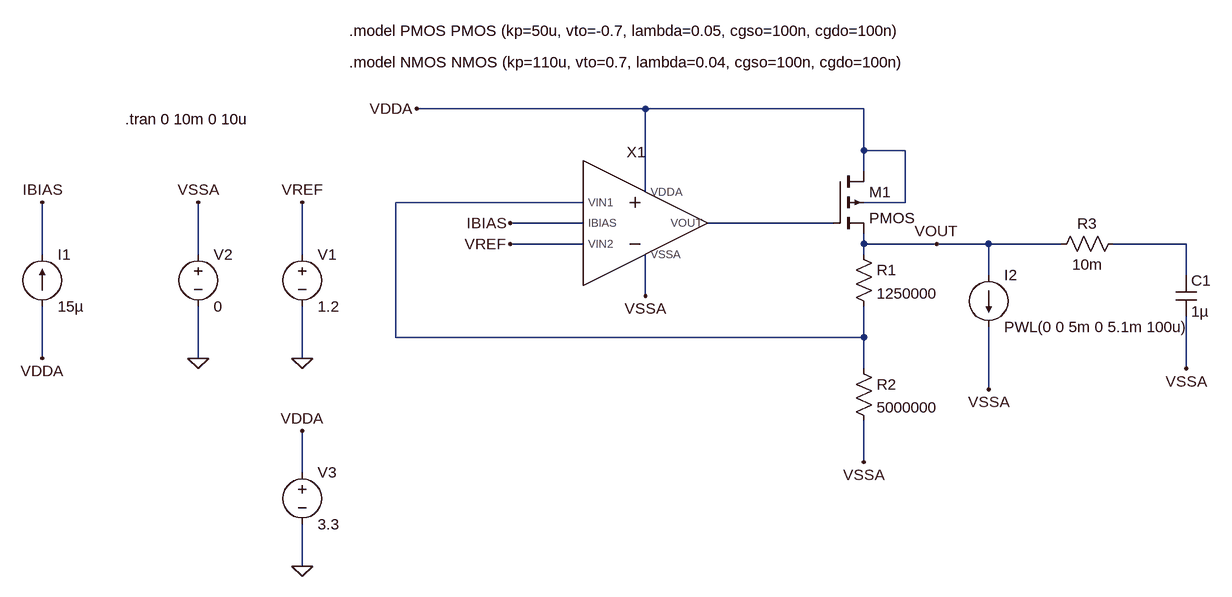
[diagram p0: schematic LDO_Transient_TB.asc]
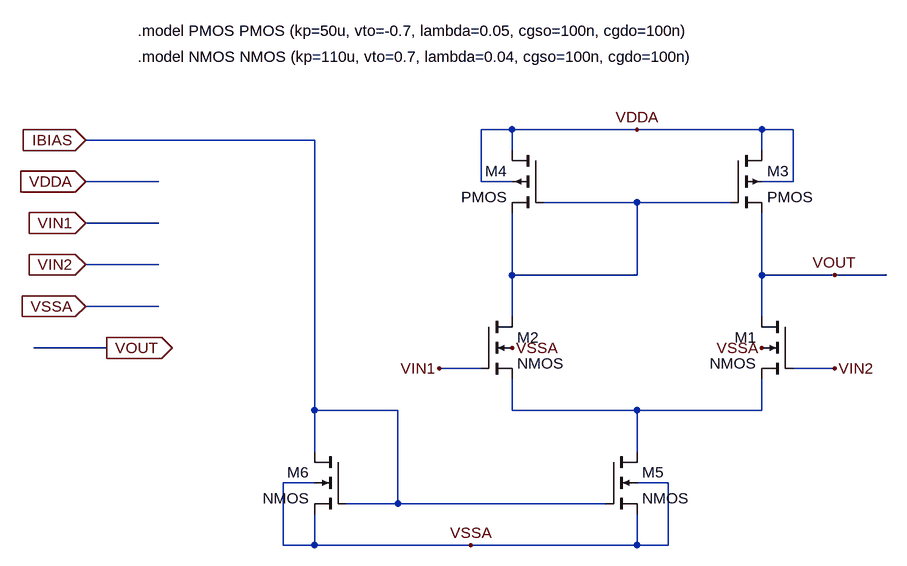
[diagram p1: sub-circuit 5tr_amp.asc]
LDO_Transient_TB.asc, the LTspice schematic file:
Version 4
SHEET 1 1112 708
WIRE 224 -16 -128 -16
WIRE 560 -16 224 -16
WIRE 560 48 560 -16
WIRE 624 48 560 48
WIRE 560 80 560 48
WIRE 224 112 224 -16
WIRE 128 128 -160 128
WIRE 624 128 624 48
WIRE 624 128 560 128
WIRE 128 160 16 160
WIRE 512 160 320 160
WIRE 128 192 16 192
WIRE 560 192 560 176
WIRE 672 192 560 192
WIRE 752 192 672 192
WIRE 864 192 752 192
WIRE 1056 192 944 192
WIRE -704 208 -704 128
WIRE -464 208 -464 128
WIRE -304 208 -304 128
WIRE 560 208 560 192
WIRE 752 240 752 192
WIRE 1056 240 1056 192
WIRE 224 272 224 208
WIRE -160 336 -160 128
WIRE 560 336 560 288
WIRE 560 336 -160 336
WIRE -704 368 -704 288
WIRE -464 368 -464 288
WIRE -304 368 -304 288
WIRE 560 384 560 336
WIRE 1056 384 1056 304
WIRE 752 416 752 320
WIRE 560 528 560 464
WIRE -304 544 -304 480
WIRE -304 688 -304 624
FLAG -128 -16 VDDA
FLAG 1056 384 VSSA
FLAG 224 272 VSSA
FLAG 16 160 IBIAS
FLAG 16 192 VREF
FLAG 560 528 VSSA
FLAG 752 416 VSSA
FLAG -464 368 0
FLAG -304 368 0
FLAG -304 688 0
FLAG -704 128 IBIAS
FLAG -464 128 VSSA
FLAG -304 128 VREF
FLAG -304 480 VDDA
FLAG -704 368 VDDA
FLAG 672 192 VOUT
SYMBOL 5TR_AMP 208 176 R0
SYMATTR InstName X1
SYMBOL pmos4 512 80 R0
SYMATTR InstName M1
SYMATTR Value2 l=0.5u w=2000u
SYMBOL res 544 192 R0
SYMATTR InstName R1
SYMATTR Value 1250000
SYMBOL res 544 368 R0
SYMATTR InstName R2
SYMATTR Value 5000000
SYMBOL res 960 176 R90
WINDOW 0 0 56 VBottom 2
WINDOW 3 32 56 VTop 2
SYMATTR InstName R3
SYMATTR Value 10m
SYMBOL cap 1040 240 R0
SYMATTR InstName C1
SYMATTR Value 1µ
SYMBOL voltage -304 192 R0
WINDOW 123 0 0 Left 0
WINDOW 39 0 0 Left 0
SYMATTR InstName V1
SYMATTR Value 1.2
SYMBOL voltage -464 192 R0
WINDOW 123 0 0 Left 0
WINDOW 39 0 0 Left 0
SYMATTR InstName V2
SYMATTR Value 0
SYMBOL voltage -304 528 R0
WINDOW 123 0 0 Left 0
WINDOW 39 0 0 Left 0
SYMATTR InstName V3
SYMATTR Value 3.3
SYMBOL current -704 288 M180
WINDOW 0 24 80 Left 2
WINDOW 3 24 0 Left 2
WINDOW 123 0 0 Left 0
WINDOW 39 0 0 Left 0
SYMATTR InstName I1
SYMATTR Value 15µ
SYMBOL current 752 240 R0
WINDOW 123 0 0 Left 0
WINDOW 39 0 0 Left 0
SYMATTR InstName I2
SYMATTR Value PWL(0 0 5m 0 5.1m 100u)
TEXT -232 -136 Left 2 !.model PMOS PMOS (kp=50u, vto=-0.7, lambda=0.05, cgso=100n, cgdo=100n)
TEXT -232 -88 Left 2 !.model NMOS NMOS (kp=110u, vto=0.7, lambda=0.04, cgso=100n, cgdo=100n)
TEXT -576 0 Left 2 !.tran 0 10m 0 10u

5tr_amp.asc, the sub-circuit schematic file:
Version 4
SHEET 1 2008 1116
WIRE 368 -368 320 -368
WIRE 560 -368 368 -368
WIRE 752 -368 560 -368
WIRE 800 -368 752 -368
WIRE 64 -352 -288 -352
WIRE 368 -336 368 -368
WIRE 752 -336 752 -368
WIRE -176 -288 -288 -288
WIRE 320 -288 320 -368
WIRE 368 -288 320 -288
WIRE 800 -288 800 -368
WIRE 800 -288 752 -288
WIRE 560 -256 416 -256
WIRE 704 -256 560 -256
WIRE -176 -224 -288 -224
WIRE -176 -160 -288 -160
WIRE 368 -144 368 -240
WIRE 560 -144 560 -256
WIRE 560 -144 368 -144
WIRE 752 -144 752 -240
WIRE 864 -144 752 -144
WIRE 944 -144 864 -144
WIRE -176 -96 -288 -96
WIRE 368 -80 368 -144
WIRE 752 -80 752 -144
WIRE -256 -32 -368 -32
WIRE 320 0 256 0
WIRE 864 0 800 0
WIRE 64 64 64 -352
WIRE 192 64 64 64
WIRE 368 64 368 16
WIRE 560 64 368 64
WIRE 752 64 752 16
WIRE 752 64 560 64
WIRE 64 128 64 64
WIRE 560 128 560 64
WIRE 64 176 16 176
WIRE 608 176 560 176
WIRE 192 208 192 64
WIRE 192 208 112 208
WIRE 512 208 192 208
WIRE 16 272 16 176
WIRE 64 272 64 224
WIRE 64 272 16 272
WIRE 304 272 64 272
WIRE 560 272 560 224
WIRE 560 272 304 272
WIRE 608 272 608 176
WIRE 608 272 560 272
FLAG 368 -32 VSSA
FLAG 752 -32 VSSA
FLAG 256 0 VIN1
FLAG 864 0 VIN2
FLAG 560 -368 VDDA
FLAG 304 272 VSSA
FLAG 864 -144 VOUT
FLAG -288 -288 VDDA
IOPIN -288 -288 In
FLAG -288 -224 VIN1
IOPIN -288 -224 In
FLAG -288 -160 VIN2
IOPIN -288 -160 In
FLAG -288 -96 VSSA
IOPIN -288 -96 In
FLAG -256 -32 VOUT
IOPIN -256 -32 Out
FLAG -288 -352 IBIAS
IOPIN -288 -352 In
DATAFLAG 752 -176 ""
SYMBOL nmos4 320 -80 R0
SYMATTR InstName M2
SYMATTR Value2 l=1u w=30u
SYMBOL nmos4 800 -80 M0
SYMATTR InstName M1
SYMATTR Value2 l=1u w=30u
SYMBOL pmos4 704 -336 R0
SYMATTR InstName M3
SYMATTR Value2 l=1u w=20u
SYMBOL pmos4 416 -336 M0
SYMATTR InstName M4
SYMATTR Value2 l=1u w=20u
SYMBOL nmos4 512 128 R0
SYMATTR InstName M5
SYMATTR Value2 l=1u w=10u
SYMBOL nmos4 112 128 M0
SYMATTR InstName M6
SYMATTR Value2 l=1u w=10u
TEXT -208 -520 Left 2 !.model PMOS PMOS (kp=50u, vto=-0.7, lambda=0.05, cgso=100n, cgdo=100n)
TEXT -208 -480 Left 2 !.model NMOS NMOS (kp=110u, vto=0.7, lambda=0.04, cgso=100n, cgdo=100n)

The netlist it stands for:
* LDO_Transient_TB.asc
XX1 VDDA N001 VREF VSSA N002 IBIAS 5tr_amp
M1 VDDA N002 VOUT VDDA PMOS l=0.5u w=2000u
R1 VOUT N001 1250000
R2 N001 VSSA 5000000
R3 N003 VOUT 10m
C1 N003 VSSA 1µ
V1 VREF 0 1.2
V2 VSSA 0 0
V3 VDDA 0 3.3
I1 VDDA IBIAS 15µ
I2 VOUT VSSA PWL(0 0 5m 0 5.1m 100u)

* block symbol definitions
.subckt 5tr_amp VDDA VIN1 VIN2 VSSA VOUT IBIAS
M2 N001 VIN1 N002 VSSA NMOS l=1u w=30u
M1 VOUT VIN2 N002 VSSA NMOS l=1u w=30u
M3 VDDA N001 VOUT VDDA PMOS l=1u w=20u
M4 VDDA N001 N001 VDDA PMOS l=1u w=20u
M5 N002 IBIAS VSSA VSSA NMOS l=1u w=10u
M6 IBIAS IBIAS VSSA VSSA NMOS l=1u w=10u
.model PMOS PMOS (kp=50u, vto=-0.7, lambda=0.05, cgso=100n, cgdo=100n)
.model NMOS NMOS (kp=110u, vto=0.7, lambda=0.04, cgso=100n, cgdo=100n)
.ends 5tr_amp

.model NMOS NMOS
.model PMOS PMOS
.lib standard.mos
.model PMOS PMOS (kp=50u, vto=-0.7, lambda=0.05, cgso=100n, cgdo=100n)
.model NMOS NMOS (kp=110u, vto=0.7, lambda=0.04, cgso=100n, cgdo=100n)
.tran 0 10m 0 10u
.backanno
.end